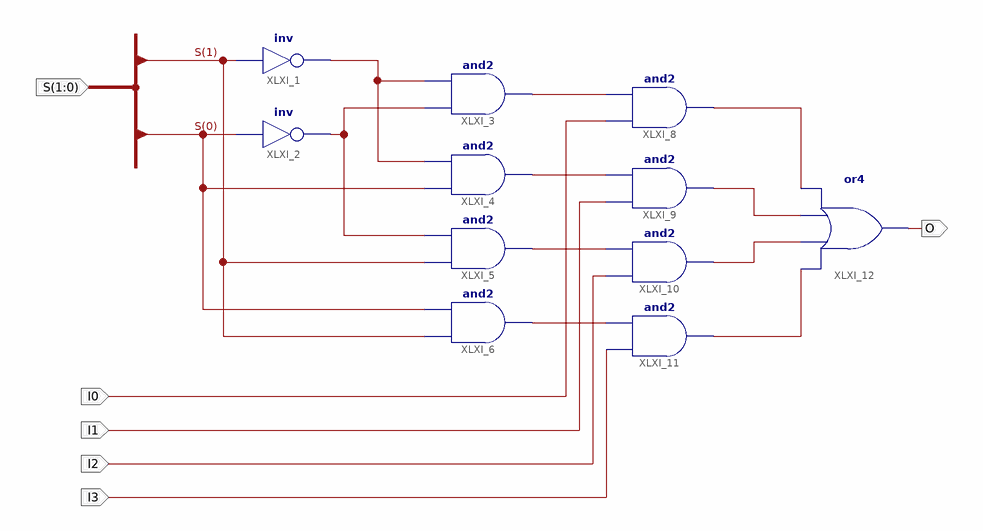
[diagram p0: schematic sheet 1]
// Xilinx ISE schematic MUX4to1.sch (kintex7) as structural Verilog: 11 symbols, 6 ports
module MUX4to1 (
  input  [1:0] S,
  input  I0,
  input  I1,
  input  I2,
  input  I3,
  output O
);

  wire XLXN_5, XLXN_7, XLXN_19, XLXN_20, XLXN_21, XLXN_22, XLXN_32, XLXN_33, XLXN_34, XLXN_35;

  not XLXI_1 (XLXN_5, S[1]);
  not XLXI_2 (XLXN_7, S[0]);
  and XLXI_3 (XLXN_19, XLXN_7, XLXN_5);
  and XLXI_4 (XLXN_20, S[0], XLXN_5);
  and XLXI_5 (XLXN_21, S[1], XLXN_7);
  and XLXI_6 (XLXN_22, S[1], S[0]);
  and XLXI_8 (XLXN_32, I0, XLXN_19);
  and XLXI_9 (XLXN_33, I1, XLXN_20);
  and XLXI_10 (XLXN_34, I2, XLXN_21);
  and XLXI_11 (XLXN_35, I3, XLXN_22);
  or XLXI_12 (O, XLXN_35, XLXN_34, XLXN_33, XLXN_32);
endmodule
